# Altium schematic sheet MOD_VIBRACION.SchDoc
size A4
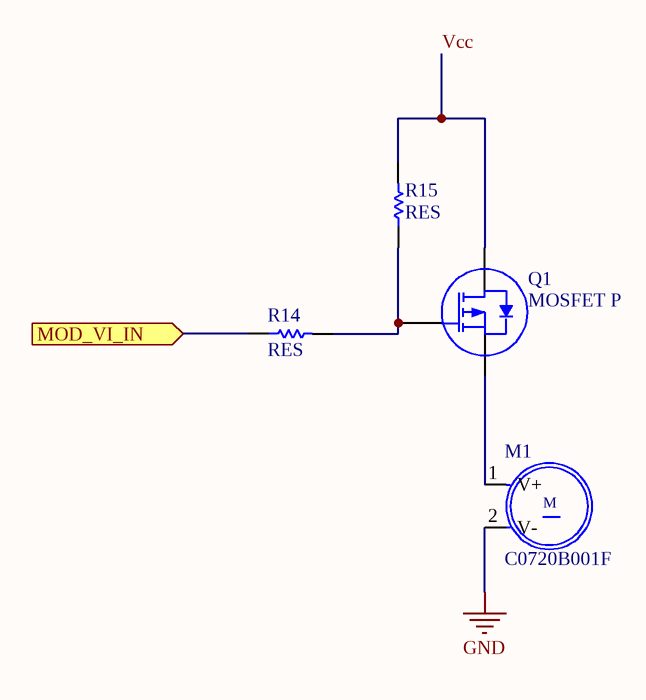
[diagram p0: MOD_VIBRACION.SchDoc]

## Parts
M1  C0720B001F  [XDCR_C0720B001F]
Q1  MOSFET P  [SOT23]
R14  RES  [0805]
R15  RES  [0805]

## Ports
MOD_VI_IN (in)

## Nets
GND: M1.2(V-)
MOD_VI_IN: R14.1 ; port MOD_VI_IN
Vcc: Q1.2(D) R15.2
NetM1_1: M1.1(V+) Q1.3(S)
NetQ1_1: Q1.1(G) R14.2 R15.1

## Notes on the sheet
- (in symbol C0720B001F) M

## Library data of the parts
M1 = C0720B001F: DC Motor Vibration, ERM 10000 RPM 3VDC; MF: Jinlong Machinery; Availability: Unavailable; SnapEDA_Link: https://www.snapeda.com/parts/C0720B001F/Jinlong%20Machinery%20%26%20Electronics%2C%20Inc./view-part/645169/?ref=snap; MP: C0720B001F; Value: *; Price: None; Package: Jinlong Machinery